# Altium schematic sheet Sheet1_1.SchDoc
size 431 x 279 mm; SheetNumber: 1; SheetTotal: 1; ENG_APP_DATE: --/--/--; DSN_APP_DATE: --/--/--; CHK_APP_DATE: --/--/--
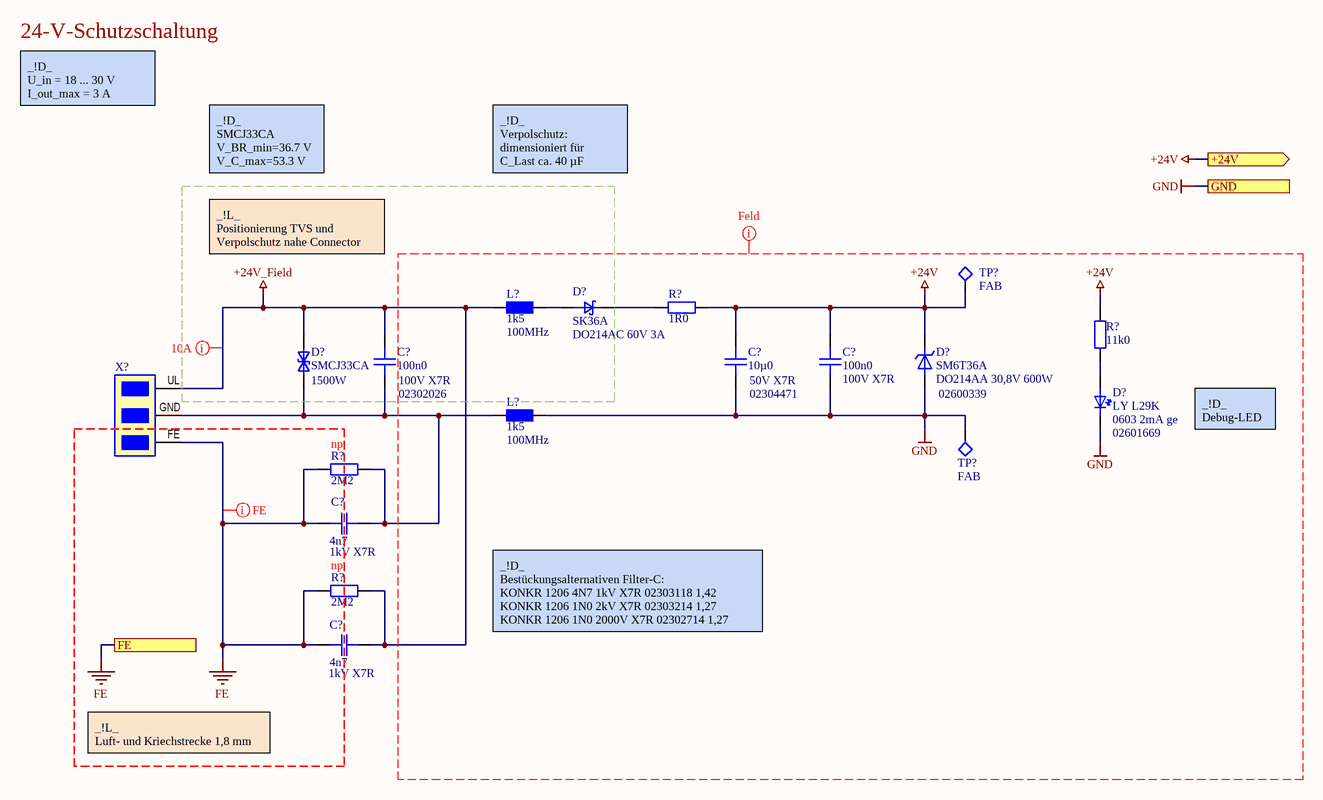
[diagram p0: Sheet1_1.SchDoc]

## Parts
(Parts that share a designator on the sheet are numbered #1, #2 ... from top to bottom, then left to right.)
C?#1  PART_ID: 02302026  NENNWERT: 100n0  PART_ZUSBEZ_GER: 100V X7R  [C_0603_H0.90]  (hidden comment: CAP_2)
C?#2  PART_ID: 02304471  NENNWERT: 10µ0  PART_ZUSBEZ_GER: 50V X7R  [C_1210_H2.70]  (hidden comment: CAP_2)
C?#3  NENNWERT: 100n0  PART_ZUSBEZ_GER: 100V X7R  [C_0603_H0.90]  (hidden comment: CAP_2)
C?#4  NENNWERT: 4n7  PART_ZUSBEZ_GER: 1kV X7R  [C_1206_H1.80_Lmax3.50]  (hidden comment: CAP_2)
C?#5  NENNWERT: 4n7  PART_ZUSBEZ_GER: 1kV X7R  [C_1206_H1.80_Lmax3.50]  (hidden comment: CAP_2)
D?#1  DIO_TYP: SK36A  PART_ZUSBEZ_GER: DO214AC 60V 3A  [D_2_DO214AC_VIS_H2.29]  (hidden comment: DIO_1x_SK)
D?#2  DIO_TYP: SMCJ33CA  LEISTUNG: 1500W  [D_2_DO214AB_H2.65]  (hidden comment: DIO_1x_TRA_BI)
D?#3  PART_ID: 02600339  DIO_TYP: SM6T36A  PART_ZUSBEZ_GER: DO214AA 30,8V 600W  [D_2_DO214AA_H2.44]  (hidden comment: DIO_1x_TRA)
D?#4  DIO_TYP: LY L29K  PART_ZUSBEZ_GER: 0603 2mA ge  Name: 02601669  [D_0603_H0.65_OSR]  (hidden comment: DIO_1x_LED)
L?#1  NENNWERT: 1k5  FREQUENZ_D: 100MHz  [L_0805_H1.10_WEK]  (hidden comment: L_1x_FER)
L?#2  NENNWERT: 1k5  FREQUENZ_D: 100MHz  [L_0805_H1.10_WEK]  (hidden comment: L_1x_FER)
R?#1  NENNWERT: 1R0  [R_0204_H1.4]  (hidden comment: RES_2)
R?#2  NENNWERT: 11k0  [R_0603_H0.65]  (hidden comment: RES_2)
R?#3  NENNWERT: 2M2  [R_0207_H2.2]  (hidden comment: RES_2)
R?#4  NENNWERT: 2M2  [R_0207_H2.2]  (hidden comment: RES_2)
TP?#1  TP_USAGE: FAB  [TP_Rnd_1000]  (hidden comment: TP_1)  (no BOM)
TP?#2  TP_USAGE: FAB  [TP_Rnd_1000]  (hidden comment: TP_1)  (no BOM)
X?  X_CON_BL20_3-POL  [X_CON_BL20_3POL]  (value not drawn)

## Ports
+24V (out), FE, GND

## Nets
+24V: C?#2.2 C?#3.2 D?#3.1 R?#1.2 R?#2.2 TP?#1.1 ; port +24V
+24V_Field: C?#1.2 C?#5.1 D?#2.1 L?#1.1 R?#4.1 X?.UL
FE: C?#4.2 C?#5.2 R?#3.2 R?#4.2 X?.FE ; port FE
GND: C?#2.1 C?#3.1 D?#3.2 D?#4.1 L?#2.2 TP?#2.1 ; port GND
NetC?#1_1: C?#1.1 C?#4.1 D?#2.2 L?#2.1 R?#3.1 X?.GND
NetD?#1_1: D?#1.1 R?#1.1
NetD?#1_2: D?#1.2 L?#1.2
NetD?#4_2: D?#4.2 R?#2.1

## Layout directives
net class NetClass_FE: FE
net class Netclass_10A: +24V_Field
net class Netclass_Feld: +24V, GND

## Notes on the sheet
- 24-V-Schutzschaltung
- _!D_
  U_in = 18 ... 30 V
  I_out_max = 3 A
- _!D_
  SMCJ33CA
  V_BR_min=36.7 V
  V_C_max=53.3 V
- _!D_
  Verpolschutz:
  dimensioniert für C_Last ca. 40 µF
- _!L_
  Positionierung TVS und Verpolschutz nahe Connector
- (near R?#3) np
- _!D_
  Debug-LED
- (near R?#4) np
- _!D_
  Bestückungsalternativen Filter-C:
  KONKR 1206 4N7 1kV X7R 02303118 1,42
  KONKR 1206 1N0 2kV X7R 02303214 1,27
  KONKR 1206 1N0 2000V X7R 02302714 1,27
- _!L_
  Luft- und Kriechstrecke 1,8 mm
- 8
- 7
- 6
- 5
- 4
- 3
- DWG. NO.
- REV.
- SHT.
- 2
- 1
- THIS DOCUMENT AND THE DATA DISCLOSED HEREIN OR HEREWITH IS THE PROPERTY OF ALTIUM LIMITED AND MAY BE FREELY DISTRIBUTED IN WHOLE. NO RIGHTS ARE RESERVED OR EXPRESS OR IMPLIED WARANTEE GIVEN.
- REVISION
- DESCRIPTION
- DATE
- APPROVED
- F
- E
- D
- C
- B
- ENG:
- APPROVALS
- PROJECT
- SUITE 200
- 2175 SALK AVENUE
- CARLSBAD, CA 92008
- A
- DSN:
- CHK:
- REFERENCE DOCUMENTS
- PROJECT REVISION:
- TITLE
- DOCUMENT REVISION:
- DESIGN ITEM:
- USA
- BOM:
- FAB DWG:
- PCB DWG:
- ASSY DWG:
- SCALE:
- SIZE
- CAGE CODE
- FILE NAME
- DWG NO.
- SHEET
- OF
- REV

## Library data of the parts
C?#1 C?#3 = 02302026: PART_NAME_GER: KONKR 0603 100n0 10%; LEV_IND: 4300; TD: X; TMEX: n; AUFBAUART: KONKR; BAUFORM: 0603; TOLERANZ_MINUS: -10%; TOLERANZ_PLUS: 10%; VDC: 100V; TEMP_MINUS: -55; TEMP_PLUS: 125; TH_MOVING_PR: 2.31; TH_PRICE_UNIT: 100; TH_LAGERBESTAND: 127568; TB_LAGERBESTAND: 109329; TB_EINKAUFSPREIS: 2.36; TDATASHEET: http://sapdocumentviewer.emea.turck.info/Main.aspx?id=2005769289; STATUS: Freigegeben; TI: X; TB: X; TU: X; TM: X; EGE: n; ESCHA: n; MECHATEC: n; AECQ: n; E_CAD: n; M_CAD: n; Name: 02302026; SAFETY_PARTS: -
  C?#3: PART_ID: 02302026
C?#2 = 02304471: PART_NAME_GER: KONKR 1210 10µ0 10%; LEV_IND: 4300; TH: X; TMEX: n; AUFBAUART: KONKR; BAUFORM: 1210; TOLERANZ_MINUS: -10%; TOLERANZ_PLUS: 10%; VDC: 50V; AECQ: y; TEMP_MINUS: -55; TEMP_PLUS: 125; TB_LAGERBESTAND: 4788; TB_EINKAUFSPREIS: 6.5; TDATASHEET: http://sapdocumentviewer.emea.turck.info/Main.aspx?id=2005088399; STATUS: Freigegeben; EGE: n; ESCHA: n; MECHATEC: n; E_CAD: n; M_CAD: n; Name: 02304471; SAFETY_PARTS: -
C?#4 C?#5 = 02303118: PART_NAME_GER: KONKR 1206 4n7 10%; LEV_IND: 4300; TH: X; TMEX: n; AUFBAUART: KONKR; BAUFORM: 1206; TOLERANZ_MINUS: -10%; TOLERANZ_PLUS: 10%; VDC: 1kV; MOVING_PR: 3.57; BESTAND: 71843; PART_ID: 02303118; TDATASHEET: http://sapdocumentviewer.emea.turck.info/Main.aspx?id=2006586712; STATUS: Freigegeben; TD: X; TI: X; TE: X; TU: X; EGE: n; ESCHA: n; MECHATEC: n; AECQ: n; E_CAD: n; M_CAD: n; PRICE_UNIT: 100; Name: 02303118; SAFETY_PARTS: -
D?#1 = 02601033: PART_NAME_GER: DIOSK SK36A; LEV_IND: 4300; TH: X; TMEX: n; AUFBAUART: DIOSK; BAUFORM: DO214AC; VDC: 60V; TEMP_MINUS: -50; TEMP_PLUS: 125; MOVING_PR: 3.18; BESTAND: 142132; PART_ID: 02601033; TDATASHEET: http://sapdocumentviewer.emea.turck.info/Main.aspx?id=2004574398; STATUS: Freigegeben; TD: X; TB: X; TE: X; TU: X; TM: X; EGE: n; ESCHA: n; MECHATEC: n; AECQ: n; E_CAD: n; M_CAD: n; PRICE_UNIT: 100; Name: 02601033; SAFETY_PARTS: -
D?#2 = 02602484: PART_NAME_GER: DIOTR SMCJ33CA; PART_ZUSBEZ_GER: DO214AB 33V 1500W; LEV_IND: 4300; TH: X; TMEX: n; AUFBAUART: DIOTR; BAUFORM: DO214AB; VDC: 33V; MOVING_PR: 10.17; BESTAND: 6234; PART_ID: 02602484; TDATASHEET: http://sapdocumentviewer.emea.turck.info/Main.aspx?id=2005869002; STATUS: Freigegeben; TB: X; TE: X; TU: X; EGE: n; ESCHA: n; MECHATEC: n; AECQ: n; E_CAD: n; M_CAD: n; PRICE_UNIT: 100; Name: 02602484; SAFETY_PARTS: -
D?#3 = 02600339: PART_NAME_GER: DIOTR SM6T36A; LEV_IND: 4300; TH: X; TMEX: n; AUFBAUART: DIOTR; BAUFORM: DO214AA; VDC: 30,8V; LEISTUNG: 600W; TEMP_MINUS: -55; TEMP_PLUS: 150; MOVING_PR: 3.53; BESTAND: 4773; TDATASHEET: http://sapdocumentviewer.emea.turck.info/Main.aspx?id=2005569290; STATUS: Freigegeben; TD: X; TI: X; TB: X; TE: X; TM: X; EGE: n; ESCHA: n; MECHATEC: n; AECQ: n; E_CAD: n; M_CAD: n; PRICE_UNIT: 100; Name: 02600339; SAFETY_PARTS: -
D?#4 = 02601669: PART_NAME_GER: DIOLD LY L29K; LEV_IND: 4300; TH: X; TMEX: n; AUFBAUART: DIOLD; BAUFORM: 0603; VDC: 1,8V; LEISTUNG: 40mW; FARBE_BIN: ge; WELLENLAENGE: 587; LICHTSTAERKE: 11,2; SICHTBARE_WINKEL: 160; TEMP_MINUS: -40; TEMP_PLUS: 100; MOVING_PR: 2.81; BESTAND: 70272; PART_ID: 02601669; TDATASHEET: http://sapdocumentviewer.emea.turck.info/Main.aspx?id=2005358556; STATUS: Freigegeben; TD: X; TB: X; TM: X; EGE: n; ESCHA: n; MECHATEC: n; AECQ: n; E_CAD: n; M_CAD: n; PRICE_UNIT: 100
L?#1 L?#2 = 02500507: PART_NAME_GER: FER 0805 1k5; PART_ZUSBEZ_GER: 25% 1A; LEV_IND: 4300; TH: X; TMEX: n; AUFBAUART: FER; BAUFORM: 0805; NENNSTROM: 1A; REFERENZ: 742792097; TOLERANZ_MINUS: -25%; TOLERANZ_PLUS: 25%; LAENGE: 2; BREITE: 1.2; HOEHE: 0.9; TEMP_MINUS: -55; TEMP_PLUS: 125; TH_MOVING_PR: 3; TH_PRICE_UNIT: 100; TH_LAGERBESTAND: 3846; TB_LAGERBESTAND: 34425; TB_EINKAUFSPREIS: 2.47; PART_ID: 02500507; TDATASHEET: http://sapdocumentviewer.emea.turck.info/Main.aspx?id=2006524422; STATUS: Freigegeben; TD: X; TB: X; TM: X; EGE: n; ESCHA: n; MECHATEC: n; AECQ: n; E_CAD: n; M_CAD: n; Name: 02500507; SAFETY_PARTS: -
R?#1 = 02000958: PART_NAME_GER: WIDMS 0204 1R0 1%; PART_ZUSBEZ_GER: 200V 0,25W TK50; LEV_IND: 4300; TH: X; TMEX: n; AUFBAUART: WIDMS; BAUFORM: 0204; TOLERANZ_MINUS: -1%; TOLERANZ_PLUS: 1%; VDC: 200V; LEISTUNG: 0,25W; TK_WERT: TK50; AECQ: y; TEMP_MINUS: -55; TEMP_PLUS: 125; MOVING_PR: 1.02; BESTAND: 32012; PART_ID: 02000958; TDATASHEET: http://sapdocumentviewer.emea.turck.info/Main.aspx?id=2006202882; STATUS: Freigegeben; TD: X; TI: X; TE: X; TU: X; TM: X; EGE: n; ESCHA: n; MECHATEC: n; E_CAD: n; M_CAD: n; PRICE_UNIT: 100; Name: 02000958; SAFETY_PARTS: -
R?#2 = 02001635: PART_NAME_GER: WIDMS 0603 11k0 1%; PART_ZUSBEZ_GER: 75V 0,1W TK100; LEV_IND: 4300; TH: X; TMEX: n; AUFBAUART: WIDMS; BAUFORM: 0603; TOLERANZ_MINUS: -1%; TOLERANZ_PLUS: 1%; VDC: 75V; LEISTUNG: 0,1W; TK_WERT: TK100; TH_MOVING_PR: 0.09; TH_PRICE_UNIT: 100; TH_LAGERBESTAND: 79435; TB_LAGERBESTAND: 58452; PART_ID: 02001635; TDATASHEET: http://sapdocumentviewer.emea.turck.info/Main.aspx?id=2006997478; STATUS: Freigegeben; TD: X; TI: X; TB: X; TE: X; TU: X; TM: X; EGE: n; ESCHA: n; MECHATEC: n; AECQ: n; E_CAD: n; M_CAD: n; Name: 02001635; SAFETY_PARTS: -; TB_EINKAUFSPREIS: 0.09
R?#3 R?#4 = 02001996: PART_NAME_GER: WIDMS 0207 2M2 1%; PART_ZUSBEZ_GER: 350V 0,4W TK50; TOLERANZ_MINUS: -1%; LEISTUNG: 0,4W; EGE: n; TD: X; AUFBAUART: WIDMS; AECQ: y; VDC: 350V; TOLERANZ_PLUS: 1%; TK_WERT: TK50; BAUFORM: 0207; LEV_IND: 4300; TEMP_MINUS: -55; TEMP_PLUS: 125; MOVING_PR: 2.58; BESTAND: 61388; ESCHA: n; TI: X; TU: X; TDATASHEET: http://sapdocumentviewer.emea.turck.info/Main.aspx?id=2006202882; E_CAD: n; MECHATEC: n; M_CAD: n; TMEX: n; TE: X; PART_ID: 02001996; STATUS: Freigegeben; PRICE_UNIT: 100; Name: 02001996; SAFETY_PARTS: -
TP?#1 TP?#2 = TP_Rnd_800_1000_1200: Testpunkt Standart Jg; PART_NAME_GER: Testpunkte 0,8 / 1,0 / 1,2mm Rund; LEV_IND: 4300; TH: x; TP_FUNCTION: PWR; PART_ID: TP_Rnd_800_1000_1200; PART_ZUSBEZ_GER: -; STATUS: Freigegeben; Name: TP_Rnd_800_1000_1200; TB: x; TE: x; TI: x; TM: x; TU: x
X? = X_CON_3P_BL20: PART_NAME_GER: CON BL20 Kontakte  UL GND FE; LEV_IND: 4300; TB: x; PART_ID: X_CON_3P_BL20; PART_ZUSBEZ_GER: -; STATUS: Freigegeben; TE: x; Name: X_CON_3P_BL20